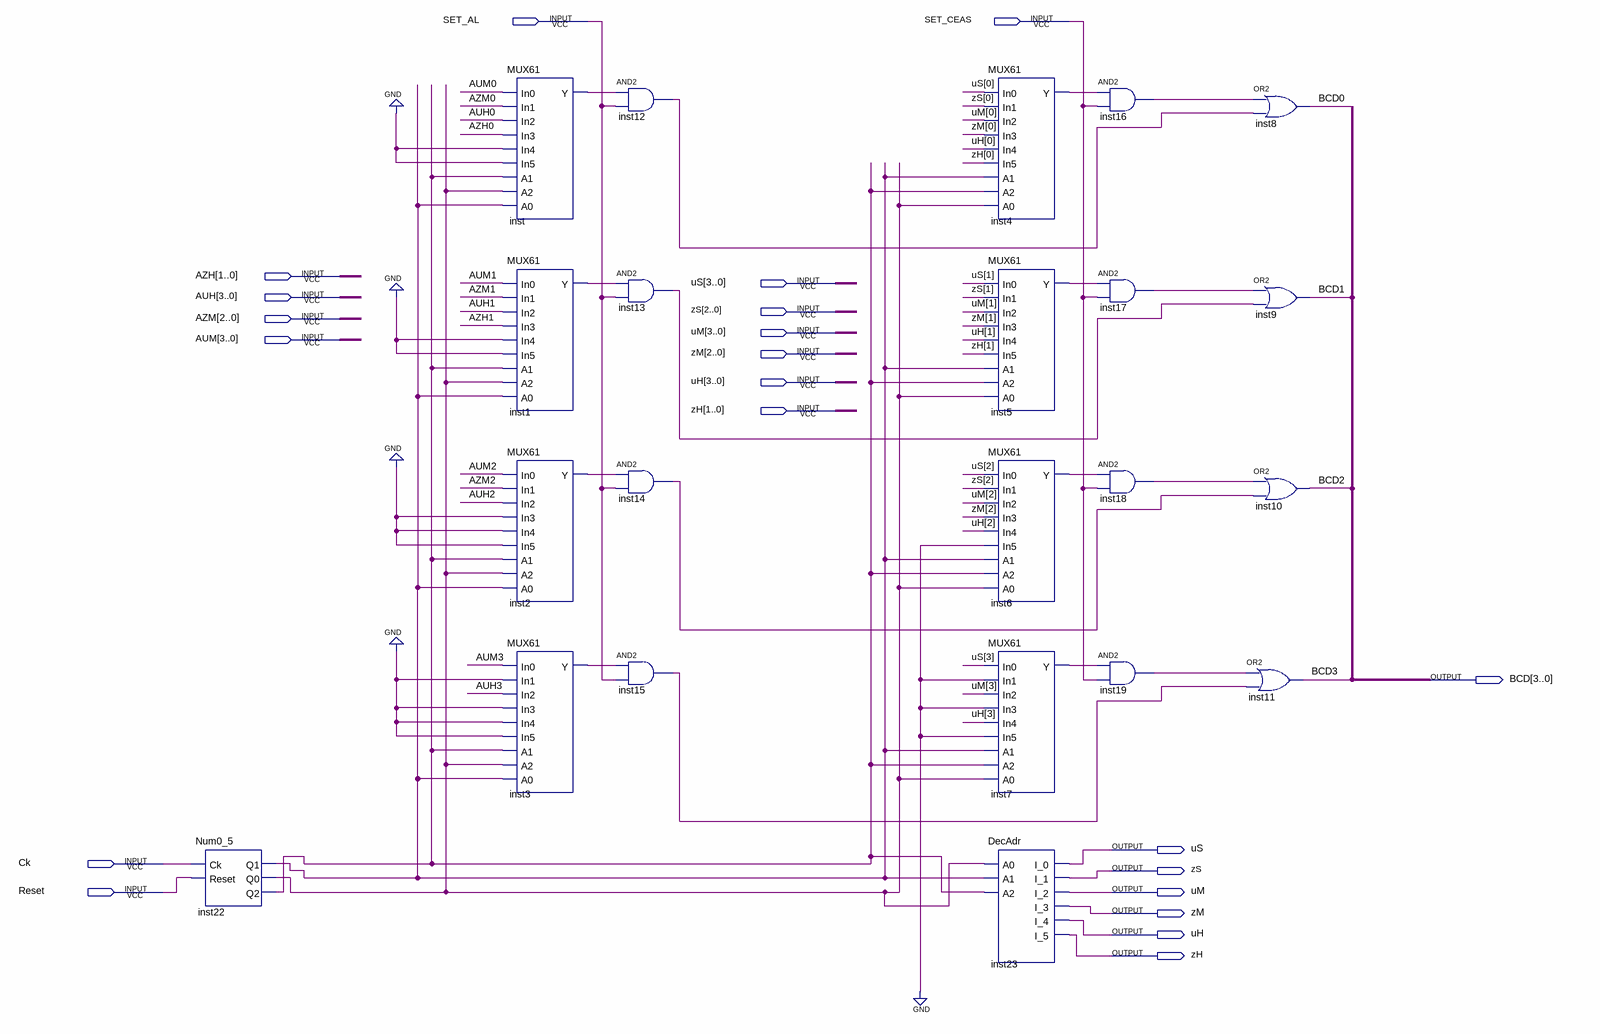
[diagram p0: schematic sheet]
// Quartus schematic BlocMUX.bdf as structural Verilog: 22 symbols, 21 pins
module BlocMUX (
  input  SET_AL,
  input  SET_CEAS,
  input  [1:0] AZH,
  input  [3:0] uS,
  input  [3:0] AUH,
  input  [2:0] zS,
  input  [2:0] AZM,
  input  [3:0] uM,
  input  [3:0] AUM,
  input  [2:0] zM,
  input  [3:0] uH,
  input  [1:0] zH,
  input  Ck,
  input  Reset,
  output [3:0] BCD,
  output uS_1bit,
  output zS_1bit,
  output uM_1bit,
  output zM_1bit,
  output uH_1bit,
  output zH_1bit
);

  wire inst1_y, inst2_y, inst3_y, inst4_y, inst5_y, inst6_y, inst7_y, inst12_out, inst13_out, inst14_out,
       inst15_out, inst16_out, inst17_out, inst18_out, inst19_out, inst22_q0, inst22_q1, inst22_q2, inst_y;

  Num0_5 inst22 (.Ck(Ck), .Reset(Reset), .Q1(inst22_q1), .Q0(inst22_q0), .Q2(inst22_q2));
  MUX61 inst (
    .In0(AUM[0]), .In1(AZM[0]), .In2(AUH[0]), .In3(AZH[0]), .In4(1'b0), .In5(1'b0), .A1(inst22_q2),
    .A2(inst22_q0), .A0(inst22_q1), .Y(inst_y));
  MUX61 inst1 (
    .In0(AUM[1]), .In1(AZM[1]), .In2(AUH[1]), .In3(AZH[1]), .In4(1'b0), .In5(1'b0), .A1(inst22_q2),
    .A2(inst22_q0), .A0(inst22_q1), .Y(inst1_y));
  MUX61 inst2 (
    .In0(AUM[2]), .In1(AZM[2]), .In2(AUH[2]), .In3(1'b0), .In4(1'b0), .In5(1'b0), .A1(inst22_q2),
    .A2(inst22_q0), .A0(inst22_q1), .Y(inst2_y));
  MUX61 inst3 (
    .In0(AUM[3]), .In1(1'b0), .In2(AUH[3]), .In3(1'b0), .In4(1'b0), .In5(1'b0), .A1(inst22_q2),
    .A2(inst22_q0), .A0(inst22_q1), .Y(inst3_y));
  and inst12 (inst12_out, inst_y, SET_AL);
  and inst13 (inst13_out, inst1_y, SET_AL);
  and inst14 (inst14_out, inst2_y, SET_AL);
  and inst15 (inst15_out, inst3_y, SET_AL);
  MUX61 inst4 (
    .In0(uS[0]), .In1(zS[0]), .In2(uM[0]), .In3(zM[0]), .In4(uH[0]), .In5(zH[0]), .A1(inst22_q1),
    .A2(inst22_q2), .A0(inst22_q0), .Y(inst4_y));
  MUX61 inst5 (
    .In0(uS[1]), .In1(zS[1]), .In2(uM[1]), .In3(zM[1]), .In4(uH[1]), .In5(zH[1]), .A1(inst22_q1),
    .A2(inst22_q2), .A0(inst22_q0), .Y(inst5_y));
  MUX61 inst6 (
    .In0(uS[2]), .In1(zS[2]), .In2(uM[2]), .In3(zM[2]), .In4(uH[2]), .In5(1'b0), .A1(inst22_q1),
    .A2(inst22_q2), .A0(inst22_q0), .Y(inst6_y));
  MUX61 inst7 (
    .In0(uS[3]), .In1(1'b0), .In2(uM[3]), .In3(1'b0), .In4(uH[3]), .In5(1'b0), .A1(inst22_q1),
    .A2(inst22_q2), .A0(inst22_q0), .Y(inst7_y));
  DecAdr inst23 (
    .A0(inst22_q0), .A1(inst22_q1), .A2(inst22_q2), .I_0(uS_1bit), .I_1(zS_1bit), .I_2(uM_1bit),
    .I_3(zM_1bit), .I_4(uH_1bit), .I_5(zH_1bit));
  and inst16 (inst16_out, inst4_y, SET_CEAS);
  and inst17 (inst17_out, inst5_y, SET_CEAS);
  and inst18 (inst18_out, inst6_y, SET_CEAS);
  and inst19 (inst19_out, inst7_y, SET_CEAS);
  or inst8 (BCD[0], inst16_out, inst12_out);
  or inst9 (BCD[1], inst17_out, inst13_out);
  or inst10 (BCD[2], inst18_out, inst14_out);
  or inst11 (BCD[3], inst19_out, inst15_out);
endmodule
